# Altium project Magic_wand_Project.PrjPcb
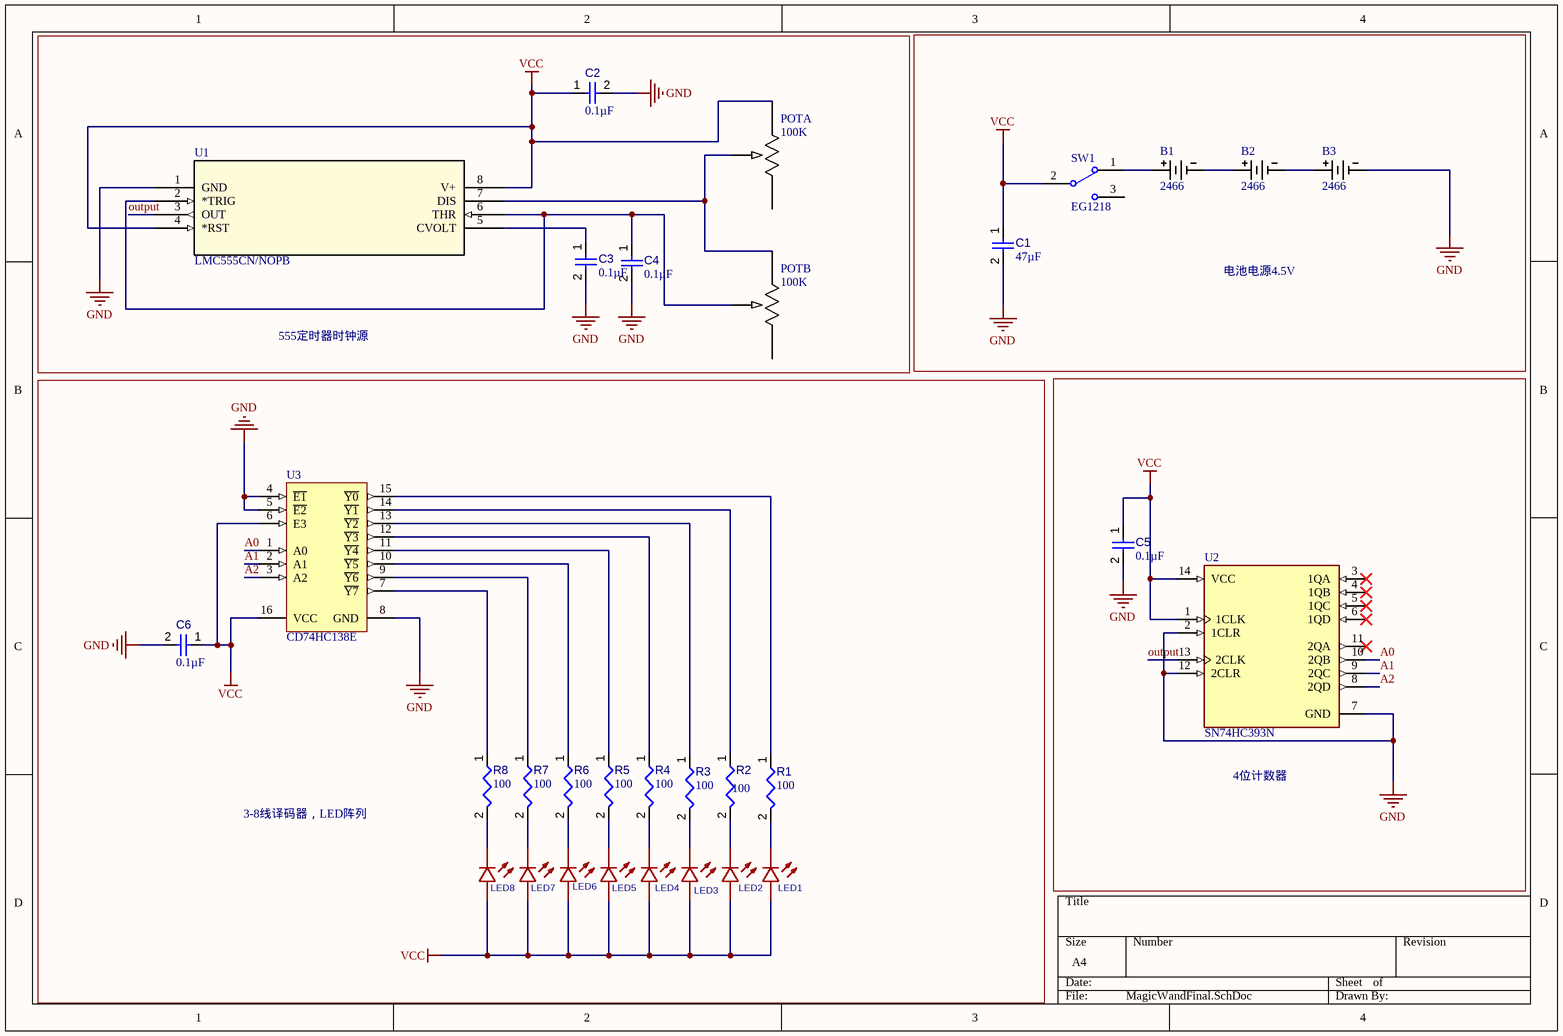
[diagram p0: MagicWandFinal.SchDoc]
1 sheet, 31 parts. Net scope: global (net labels, ports and power ports of the same name join across sheets).
Board file: MagicWandFinal.PcbDoc

## Sheet MagicWandFinal.SchDoc
size A4; SheetNumber: 1; SheetTotal: 1

### Parts
B1  2466  [2466_KEY]
B2  2466  [2466_KEY]
B3  2466  [2466_KEY]
C1  value 47µF  [CAPC0805(2012)145_L]  (hidden comment: Capacitor 47µF +/-40% 6.3V 0805)
C2  value 0.1µF  [CAPC0805(2012)145_L]  (hidden comment: Capacitor 47µF +/-40% 6.3V 0805)
C3  value 0.1µF  [CAPC0805(2012)145_L]  (hidden comment: Capacitor 47µF +/-40% 6.3V 0805)
C4  value 0.1µF  [CAPC0805(2012)145_L]  (hidden comment: Capacitor 47µF +/-40% 6.3V 0805)
C5  value 0.1µF  [CAPC0805(2012)145_L]  (hidden comment: Capacitor 47µF +/-40% 6.3V 0805)
C6  value 0.1µF  [CAPC0805(2012)145_L]  (hidden comment: Capacitor 47µF +/-40% 6.3V 0805)
LED1  FC-DA1608HRK-620D  [LED0603-RD_RED]  (value not drawn)
LED2  FC-DA1608HRK-620D  [LED0603-RD_RED]  (value not drawn)
LED3  FC-DA1608HRK-620D  [LED0603-RD_RED]  (value not drawn)
LED4  FC-DA1608HRK-620D  [LED0603-RD_RED]  (value not drawn)
LED5  FC-DA1608HRK-620D  [LED0603-RD_RED]  (value not drawn)
LED6  FC-DA1608HRK-620D  [LED0603-RD_RED]  (value not drawn)
LED7  FC-DA1608HRK-620D  [LED0603-RD_RED]  (value not drawn)
LED8  FC-DA1608HRK-620D  [LED0603-RD_RED]  (value not drawn)
POTA  100K  [POT_CT-6EP103_NDC]
POTB  100K  [POT_CT-6EP103_NDC]
R1  value 100  [RESC0402(1005)_L]  (hidden comment: Resistor 100R +/-1 % 0402 63 mW)
R2  value 100  [RESC0402(1005)_L]  (hidden comment: Resistor 100R +/-1 % 0402 63 mW)
R3  value 100  [RESC0402(1005)_L]  (hidden comment: Resistor 100R +/-1 % 0402 63 mW)
R4  value 100  [RESC0402(1005)_L]  (hidden comment: Resistor 100R +/-1 % 0402 63 mW)
R5  value 100  [RESC0402(1005)_L]  (hidden comment: Resistor 100R +/-1 % 0402 63 mW)
R6  value 100  [RESC0402(1005)_L]  (hidden comment: Resistor 100R +/-1 % 0402 63 mW)
R7  value 100  [RESC0402(1005)_L]  (hidden comment: Resistor 100R +/-1 % 0402 63 mW)
R8  value 100  [RESC0402(1005)_L]  (hidden comment: Resistor 100R +/-1 % 0402 63 mW)
SW1  EG1218  [ESWI-EG1218_V]
U1  LMC555CN/NOPB  [N08E_TEX]
U2  SN74HC393N  [FP-N0014A-MFG]
U3  CD74HC138E  [N0016A]

### Blocks framed on the sheet
555定时器时钟源: C2-C4 POTA POTB U1
电池电源4.5V: B1-B3 C1 SW1
3-8线译码器，LED阵列: C6 LED1-LED8 R1-R8 U3
4位计数器: C5 U2

### Nets
GND: B3.1 C1.2 C2.2 C3.2 C4.2 C5.2 C6.2 U1.1(GND) U2.2(1CLR) U2.7(GND) U2.12(2CLR) U3.4(~{E1}) U3.5(~{E2}) U3.8(GND)
VCC: C1.1 C2.1 C5.1 C6.1 LED1.2(A) LED2.2(A) LED3.2(A) LED4.2(A) LED5.2(A) LED6.2(A) LED7.2(A) LED8.2(A) POTA.3 SW1.2(COM) U1.4(*RST) U1.8(V+) U2.1(1CLK) U2.14(VCC) U3.6(E3) U3.16(VCC)
A0: U2.10(2QB) U3.1(A0)
A1: U2.9(2QC) U3.2(A1)
A2: U2.8(2QD) U3.3(A2)
output: U1.3(OUT) U2.13(2CLK)
NetB1_1: B1.1 B2.2
NetB1_2: B1.2 SW1.1
NetB2_1: B2.1 B3.2
NetC3_1: C3.1 U1.5(CVOLT)
NetC4_1: C4.1 POTB.2 U1.2(*TRIG) U1.6(THR)
NetLED1_1: LED1.1(K) R1.2
NetLED2_1: LED2.1(K) R2.2
NetLED3_1: LED3.1(K) R3.2
NetLED4_1: LED4.1(K) R4.2
NetLED5_1: LED5.1(K) R5.2
NetLED6_1: LED6.1(K) R6.2
NetLED7_1: LED7.1(K) R7.2
NetLED8_1: LED8.1(K) R8.2
NetPOTA_2: POTA.2 POTB.3 U1.7(DIS)
NetR1_1: R1.1 U3.15(~{Y0})
NetR2_1: R2.1 U3.14(~{Y1})
NetR3_1: R3.1 U3.13(~{Y2})
NetR4_1: R4.1 U3.12(~{Y3})
NetR5_1: R5.1 U3.11(~{Y4})
NetR6_1: R6.1 U3.10(~{Y5})
NetR7_1: R7.1 U3.9(~{Y6})
NetR8_1: R8.1 U3.7(~{Y7})

Not connected (* = marked no-connect by the designer): POTA 1; POTB 1; SW1 3; U2 3(1QA)* 4(1QB)* 5(1QC)* 6(1QD)* 11(2QA)*

### Library data of the parts
B1-B3 = 2466: Description; Manufacturer_Name: Keystone Electronics; Copyright: Copyright (C) 2025 Ultra Librarian. All rights reserved.; Manufacturer_Part_Number: 2466
C1-C6 = CMP-001-00082-4: Chip Capacitor, 47µF +/-40%, 6.3V, 0805, Thickness 1.45 mm; Tolerance: 10%; Min Operating Temperature: -55°C; Max Operating Temperature: 85°C; Case/Package: 0805; Pins: 2; Mounting Technology: SMT; Voltage Rating: 6.3V
POTA POTB = CT-6EP103: Description; Manufacturer_Name: Nidec Copal Electronics; Type: Trimmer Potentiometers; Copyright: Copyright (C) 2026 Ultra Librarian. All rights reserved.; Manufacturer_Part_Number: CT-6EP103
R1-R8 = CMP-009-00167-3: Chip Resistor, 100 Ohms, +/-1 %, 63 mW, -55 to 155 degC, 0402; Power: 63mW; Tolerance: 1%; Min Operating Temperature: -55°C; Case/Package: 0402; Pins: 2; Max Operating Temperature: 155°C
SW1 = CMP-1696-00002-1: Slide Switch, 500 V, -20 to 70 degC, 3-Pin THD, RoHS; Case\Package: SOT-23-5; Output Current: 150 mA; Nominal Output Voltage: 3.3 V; Max Power Dissipation: 250 mW; Min Input Voltage: 4.3 V; Outputs: 1; Max Input Voltage: 8 V; Dropout Voltage: 300 mV; PackageDescription: 3-Pin Through Hole Device, Body 11.6 x 4 mm, Pitch 2.5 mm; ComponentLink1URL: http://www.e-switch.ch/en/; RoHSCompliant: true; Length: 3 mm; ComponentLink1Description: Manufacturer URL; Power Rating: 250 mW; Mount: Surface Mount; Max Operating Temperature: 85 degC; REACH SVHC: No SVHC; Radiation Hardening: No; Height: 1.3 mm; Pins: 5; Max Ouput Current: 150 mA; Output Voltage: 3.3 V; Width: 1.8 mm; Package Quantity: 3000; ComponentLink2URL: https://www.e-switch.com/system/asset/product_line/data_sheet/119/EG.pdf; Min Operating Temperature: -40 degC; ComponentLink2Description: Datasheet; DatasheetVersion: Oct-15; PackageReference: EG1218; Packaging: Tape and Reel
U1 = LMC555CNNOPB: Worldâ€™s smallest 555 timer with low power, high accuracy and a Fmax of 3MHz 8-PDIP -40 to 85; Manufacturer_Name: Texas Instruments; Copyright: Copyright (C) 2025 Ultra Librarian. All rights reserved.; Manufacturer_Part_Number: LMC555CN/NOPB; RefDes: RefDes; Type: Type
U2 = CMP-1623-00479-3: IC DUAL 4-BIT BIN CNTR 14-DIP; Reset: Asynchronous; Number of Elements: 2; Clock Edge Trigger Type: Negative Edge; Min Supply Voltage: 2V; Frequency: 60MHz; Max Supply Voltage: 6V; Number of Bits per Element: 4; Turn-On Delay Time: 360ns; Operating Supply Voltage: 5V; Direction: Up; Logic Function: Counter; Package Quantity: 25; Packaging: Rail/Tube; Series: 74HC; Technology: CMOS; Max Operating Temperature: 85°C; Number of Pins: 14; Radiation Hardening: No; Case/Package: PDIP; Weight: 0.032734oz; Contact Plating: Gold; REACH SVHC: No SVHC; Lead Free: Lead Free; Min Operating Temperature: -40°C; Number of Bits: 4; RoHS Compliant: Yes; Propagation Delay: 360ns; Mount: Through Hole
U3 = CMP-1633-00630-2: High Speed CMOS Logic 3-to-8 Line Decoder Demultiplexer Inverting and Non-Inverting, N0016A, TUBE; Manufacturer: Texas Instruments; ICC @ Nom Voltage(Max)(mA): 0.08; Channels(#): 1; Output Drive (IOL/IOH)(Max)(mA): 5.2/-5.2; Schmitt Trigger: No; Configuration: 3：8; tpd @ Nom Voltage(Max)(ns): 30; Voltage(Nom)(V): 3.3,5; VCC(Max)(V): 6; Technology Family: HC; Function: Decoder/Demultiplexer; Rating: Catalog; F @ Nom Voltage(Max)(Mhz): 28; VCC(Min)(V): 2; Input Type: LVTTL/CMOS; Bits(#): 8; Generic Part Number: CD74HC138; Operating Temperature Range(C): -55 to 125; PackageReference: N0016A; Type: Standard; DatasheetVersion: SCHS147I; Code_JEDEC: MS-001; Output Type: CMOS
LED1-LED8 = FC-DA1608HRK-620D: Symbol: FC-DA1608HRK-620D